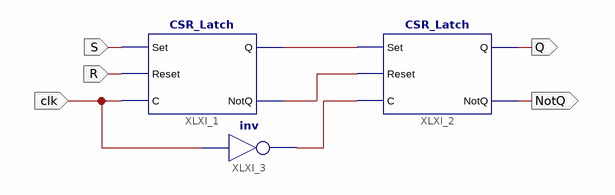
[diagram p0: schematic sheet 1]
// Xilinx ISE schematic MS_FlipFlop.sch (kintex7) as structural Verilog: 3 symbols, 5 ports
module MS_FlipFlop (
  input  clk,
  input  S,
  input  R,
  output Q,
  output NotQ
);

  wire XLXN_1, XLXN_2, XLXN_3;

  CSR_Latch XLXI_1 (.Set(S), .Reset(R), .C(clk), .Q(XLXN_1), .NotQ(XLXN_2));
  CSR_Latch XLXI_2 (.Set(XLXN_1), .Reset(XLXN_2), .C(XLXN_3), .Q(Q), .NotQ(NotQ));
  not XLXI_3 (XLXN_3, clk);
endmodule
